# Altium schematic sheet Open Reactor Control System - Analogue & IO Interfaces.SchDoc: ORC - Analogue & IO Interfaces
size A3; Author: Peake J; CompanyName: Scion Research; DrawnBy: Peake J; Engineer: Peake J; Organization: Scion; Address1: 49 Sala St; Address2: Whakarewarewa; Address3: Rotorua; Address4: New Zealand 3010; DocumentNumber: 0-5; Revision: 2; SheetNumber: 4; SheetTotal: 5
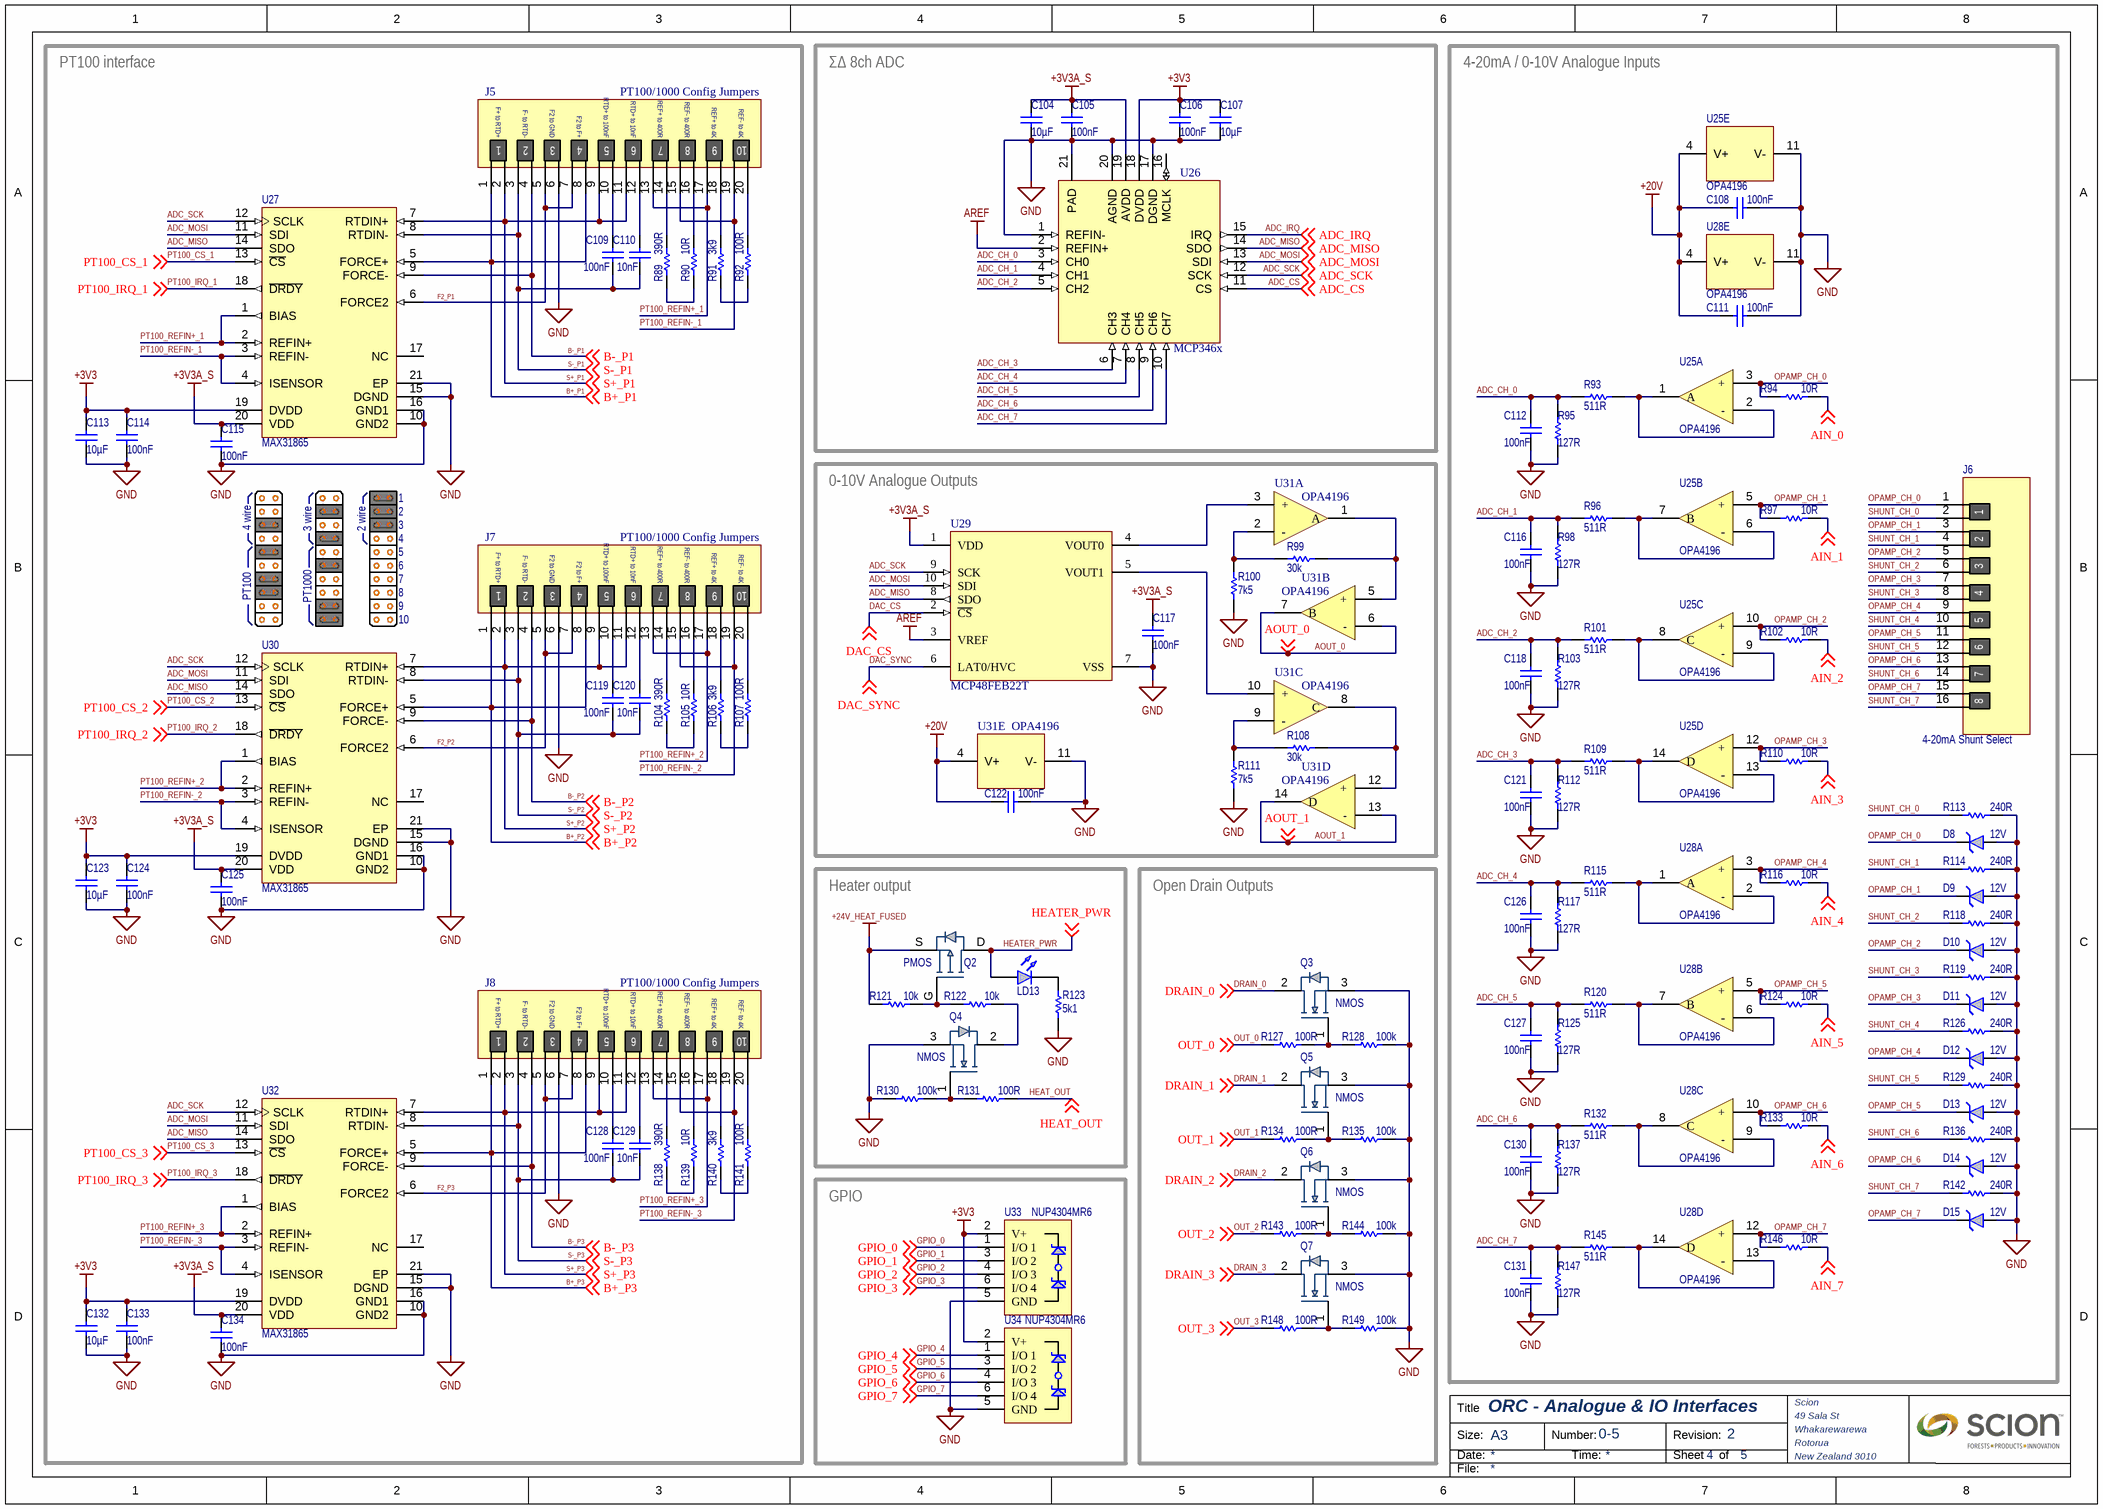
[diagram p0: Open Reactor Control System - Analogue & IO Interfaces.SchDoc]

## Parts
C104  value 10µF  [0603_CAP]  (hidden comment: Capacitor)
C105  value 100nF  [0603_CAP]  (hidden comment: Capacitor)
C106  value 100nF  [0603_CAP]  (hidden comment: Capacitor)
C107  value 10µF  [0603_CAP]  (hidden comment: Capacitor)
C108  value 100nF  [0603_CAP]  (hidden comment: Capacitor)
C109  value 100nF  [0603_CAP]  (hidden comment: Capacitor)
C110  value 10nF  [0603_CAP]  (hidden comment: Capacitor)
C111  value 100nF  [0603_CAP]  (hidden comment: Capacitor)
C112  value 100nF  [0603_CAP]  (hidden comment: Capacitor)
C113  value 10µF  [0603_CAP]  (hidden comment: Capacitor)
C114  value 100nF  [0603_CAP]  (hidden comment: Capacitor)
C115  value 100nF  [0603_CAP]  (hidden comment: Capacitor)
C116  value 100nF  [0603_CAP]  (hidden comment: Capacitor)
C117  value 100nF  [0603_CAP]  (hidden comment: Capacitor)
C118  value 100nF  [0603_CAP]  (hidden comment: Capacitor)
C119  value 100nF  [0603_CAP]  (hidden comment: Capacitor)
C120  value 10nF  [0603_CAP]  (hidden comment: Capacitor)
C121  value 100nF  [0603_CAP]  (hidden comment: Capacitor)
C122  value 100nF  [0603_CAP]  (hidden comment: Capacitor)
C123  value 10µF  [0603_CAP]  (hidden comment: Capacitor)
C124  value 100nF  [0603_CAP]  (hidden comment: Capacitor)
C125  value 100nF  [0603_CAP]  (hidden comment: Capacitor)
C126  value 100nF  [0603_CAP]  (hidden comment: Capacitor)
C127  value 100nF  [0603_CAP]  (hidden comment: Capacitor)
C128  value 100nF  [0603_CAP]  (hidden comment: Capacitor)
C129  value 10nF  [0603_CAP]  (hidden comment: Capacitor)
C130  value 100nF  [0603_CAP]  (hidden comment: Capacitor)
C131  value 100nF  [0603_CAP]  (hidden comment: Capacitor)
C132  value 10µF  [0603_CAP]  (hidden comment: Capacitor)
C133  value 100nF  [0603_CAP]  (hidden comment: Capacitor)
C134  value 100nF  [0603_CAP]  (hidden comment: Capacitor)
D8  Rated Voltage: 12V  [SMBJ]  (hidden comment: Transil)
D9  Rated Voltage: 12V  [SMBJ]  (hidden comment: Transil)
D10  Rated Voltage: 12V  [SMBJ]  (hidden comment: Transil)
D11  Rated Voltage: 12V  [SMBJ]  (hidden comment: Transil)
D12  Rated Voltage: 12V  [SMBJ]  (hidden comment: Transil)
D13  Rated Voltage: 12V  [SMBJ]  (hidden comment: Transil)
D14  Rated Voltage: 12V  [SMBJ]  (hidden comment: Transil)
D15  Rated Voltage: 12V  [SMBJ]  (hidden comment: Transil)
J5  PT100/1000 Config Jumpers  [20P 1.27mm SMD DIP male header]
J6  4-20mA Shunt Select  [16P 1.27mm SMD DIP male header]
J7  PT100/1000 Config Jumpers  [20P 1.27mm SMD DIP male header]
J8  PT100/1000 Config Jumpers  [20P 1.27mm SMD DIP male header]
LD13  LED  [0805]  (value not drawn)
Q2  PMOS  [PowerDI 5060-8]
Q3  NMOS  [SOT-23]
Q4  NMOS  [SOT-23]
Q5  NMOS  [SOT-23]
Q6  NMOS  [SOT-23]
Q7  NMOS  [SOT-23]
R89  value 390R  [0603_RES]  (hidden comment: Resistor)
R90  value 10R  [0603_RES]  (hidden comment: Resistor)
R91  value 3k9  [0603_RES]  (hidden comment: Resistor)
R92  value 100R  [0603_RES]  (hidden comment: Resistor)
R93  value 511R  [0603_RES]  (hidden comment: Resistor)
R94  value 10R  [0603_RES]  (hidden comment: Resistor)
R95  value 127R  [0603_RES]  (hidden comment: Resistor)
R96  value 511R  [0603_RES]  (hidden comment: Resistor)
R97  value 10R  [0603_RES]  (hidden comment: Resistor)
R98  value 127R  [0603_RES]  (hidden comment: Resistor)
R99  value 30k  [0603_RES]  (hidden comment: Resistor)
R100  value 7k5  [0603_RES]  (hidden comment: Resistor)
R101  value 511R  [0603_RES]  (hidden comment: Resistor)
R102  value 10R  [0603_RES]  (hidden comment: Resistor)
R103  value 127R  [0603_RES]  (hidden comment: Resistor)
R104  value 390R  [0603_RES]  (hidden comment: Resistor)
R105  value 10R  [0603_RES]  (hidden comment: Resistor)
R106  value 3k9  [0603_RES]  (hidden comment: Resistor)
R107  value 100R  [0603_RES]  (hidden comment: Resistor)
R108  value 30k  [0603_RES]  (hidden comment: Resistor)
R109  value 511R  [0603_RES]  (hidden comment: Resistor)
R110  value 10R  [0603_RES]  (hidden comment: Resistor)
R111  value 7k5  [0603_RES]  (hidden comment: Resistor)
R112  value 127R  [0603_RES]  (hidden comment: Resistor)
R113  value 240R  [1206_RES]  (hidden comment: Resistor)
R114  value 240R  [1206_RES]  (hidden comment: Resistor)
R115  value 511R  [0603_RES]  (hidden comment: Resistor)
R116  value 10R  [0603_RES]  (hidden comment: Resistor)
R117  value 127R  [0603_RES]  (hidden comment: Resistor)
R118  value 240R  [1206_RES]  (hidden comment: Resistor)
R119  value 240R  [1206_RES]  (hidden comment: Resistor)
R120  value 511R  [0603_RES]  (hidden comment: Resistor)
R121  value 10k  [0603_RES]  (hidden comment: Resistor)
R122  value 10k  [0603_RES]  (hidden comment: Resistor)
R123  value 5k1  [0603_RES]  (hidden comment: Resistor)
R124  value 10R  [0603_RES]  (hidden comment: Resistor)
R125  value 127R  [0603_RES]  (hidden comment: Resistor)
R126  value 240R  [1206_RES]  (hidden comment: Resistor)
R127  value 100R  [0603_RES]  (hidden comment: Resistor)
R128  value 100k  [0603_RES]  (hidden comment: Resistor)
R129  value 240R  [1206_RES]  (hidden comment: Resistor)
R130  value 100k  [0603_RES]  (hidden comment: Resistor)
R131  value 100R  [0603_RES]  (hidden comment: Resistor)
R132  value 511R  [0603_RES]  (hidden comment: Resistor)
R133  value 10R  [0603_RES]  (hidden comment: Resistor)
R134  value 100R  [0603_RES]  (hidden comment: Resistor)
R135  value 100k  [0603_RES]  (hidden comment: Resistor)
R136  value 240R  [1206_RES]  (hidden comment: Resistor)
R137  value 127R  [0603_RES]  (hidden comment: Resistor)
R138  value 390R  [0603_RES]  (hidden comment: Resistor)
R139  value 10R  [0603_RES]  (hidden comment: Resistor)
R140  value 3k9  [0603_RES]  (hidden comment: Resistor)
R141  value 100R  [0603_RES]  (hidden comment: Resistor)
R142  value 240R  [1206_RES]  (hidden comment: Resistor)
R143  value 100R  [0603_RES]  (hidden comment: Resistor)
R144  value 100k  [0603_RES]  (hidden comment: Resistor)
R145  value 511R  [0603_RES]  (hidden comment: Resistor)
R146  value 10R  [0603_RES]  (hidden comment: Resistor)
R147  value 127R  [0603_RES]  (hidden comment: Resistor)
R148  value 100R  [0603_RES]  (hidden comment: Resistor)
R149  value 100k  [0603_RES]  (hidden comment: Resistor)
U25  OPA4196  [SOIC_14]  (parts A,B,C,D,E of 5)
U26  MCP346x  [20P_TSSOP]
U27  MAX31865  [MAXM-T2055+5_L]
U28  OPA4196  [SOIC_14]  (parts A,B,C,D,E of 5)
U29  MCP48FEB22T  [FP-C04-021-UN-IPC_C]
U30  MAX31865  [MAXM-T2055+5_L]
U31  OPA4196  [SOIC_14]  (parts A,B,C,D,E of 5)
U32  MAX31865  [MAXM-T2055+5_L]
U33  NUP4304MR6  [TSOP-6]
U34  NUP4304MR6  [TSOP-6]

## Blocks framed on the sheet
PT100 interface: C109 C110 C113-C115 C119 C120 C123-C125 C128 C129 C132-C134 J5 J7 J8 R89-R92 R104-R107 R138-R141 U27 U30 U32
ΣΔ 8ch ADC: C104-C107 U26
4-20mA / 0-10V Analogue Inputs: C108 C111 C112 C116 C118 C121 C126 C127 C130 C131 D8-D15 J6 R93-R98 R101-R103 R109 R110 R112-R120 R124-R126 R129 R132 R133 R136 R137 R142 R145-R147 U25 U28
0-10V Analogue Outputs: C117 C122 R99 R100 R108 R111 U29 U31
Heater output: LD13 Q2 Q4 R121-R123 R130 R131
Open Drain Outputs: Q3 Q5-Q7 R127 R128 R134 R135 R143 R144 R148 R149
GPIO: U33 U34

## Nets
+3V3: C106.1 C107.1 C113.1 C114.1 C123.1 C124.1 C132.1 C133.1 U26.18(DVDD) U27.19(DVDD) U30.19(DVDD) U32.19(DVDD) U33.2(V+) U34.2(V+)
+3V3A_S: C104.1 C105.1 C115.1 C117.1 C125.1 C134.1 U26.19(AVDD) U27.20(VDD) U29.1(VDD) U30.20(VDD) U32.20(VDD)
+20V: C108.1 C111.1 C122.2 U25.4(V+) U28.4(V+) U31.4(V+)
+24V_HEAT_FUSED: Q2.S R121.2
AREF: U26.2(REFIN+) U29.3(VREF)
GND: C104.2 C105.2 C106.2 C107.2 C108.2 C111.2 C112.2 C113.2 C114.2 C115.2 C116.2 C117.2 C118.2 C121.2 C122.1 C123.2 C124.2 C125.2 C126.2 C127.2 C130.2 C131.2 C132.2 C133.2 C134.2 D8.1(A) D9.1(A) D10.1(A) D11.1(A) D12.1(A) D13.1(A) D14.1(A) D15.1(A) J5.6 J7.6 J8.6 Q3.3(S) Q4.3(S) Q5.3(S) Q6.3(S) Q7.3(S) R95.1 R98.1 R100.2 R103.1 R111.2 R112.1 R113.1 R114.1 R117.1 R118.1 R119.1 R123.1 R125.1 R126.1 R128.1 R129.1 R130.2 R135.1 R136.1 R137.1 R142.1 R144.1 R147.1 R149.1 U25.11(V-) U26.1(REFIN-) U26.17(DGND) U26.20(AGND) U26.21(PAD) U27.10(GND2) U27.15(DGND) U27.16(GND1) U27.21(EP) U28.11(V-) U29.7(VSS) U30.10(GND2) U30.15(DGND) U30.16(GND1) U30.21(EP) U31.11(V-) U32.10(GND2) U32.15(DGND) U32.16(GND1) U32.21(EP) U33.5(GND) U34.5(GND)
ADC_CH_0: C112.1 R93.2 R95.2 U26.3(CH0)
ADC_CH_1: C116.1 R96.2 R98.2 U26.4(CH1)
ADC_CH_2: C118.1 R101.2 R103.2 U26.5(CH2)
ADC_CH_3: C121.1 R109.2 R112.2 U26.6(CH3)
ADC_CH_4: C126.1 R115.2 R117.2 U26.7(CH4)
ADC_CH_5: C127.1 R120.2 R125.2 U26.8(CH5)
ADC_CH_6: C130.1 R132.2 R137.2 U26.9(CH6)
ADC_CH_7: C131.1 R145.2 R147.2 U26.10(CH7)
ADC_CS: U26.11(CS) ; off-sheet ADC_CS
ADC_IRQ: U26.15(IRQ) ; off-sheet ADC_IRQ
ADC_MISO: U26.14(SDO) U27.14(SDO) U29.8(SDO) U30.14(SDO) U32.14(SDO) ; off-sheet ADC_MISO
ADC_MOSI: U26.13(SDI) U27.11(SDI) U29.10(SDI) U30.11(SDI) U32.11(SDI) ; off-sheet ADC_MOSI
ADC_SCK: U26.12(SCK) U27.12(SCLK) U29.9(SCK) U30.12(SCLK) U32.12(SCLK) ; off-sheet ADC_SCK
AIN_0: R94.1 ; off-sheet AIN_0
AIN_1: R97.1 ; off-sheet AIN_1
AIN_2: R102.1 ; off-sheet AIN_2
AIN_3: R110.1 ; off-sheet AIN_3
AIN_4: R116.1 ; off-sheet AIN_4
AIN_5: R124.1 ; off-sheet AIN_5
AIN_6: R133.1 ; off-sheet AIN_6
AIN_7: R146.1 ; off-sheet AIN_7
AOUT_0: U31.6(-) U31.7(B) ; off-sheet AOUT_0
AOUT_1: U31.13(-) U31.14(D) ; off-sheet AOUT_1
B+_P1: J5.1 J5.8 U27.5(FORCE+) ; off-sheet B+_P1
B+_P2: J7.1 J7.8 U30.5(FORCE+) ; off-sheet B+_P2
B+_P3: J8.1 J8.8 U32.5(FORCE+) ; off-sheet B+_P3
B-_P1: J5.4 U27.9(FORCE-) ; off-sheet B-_P1
B-_P2: J7.4 U30.9(FORCE-) ; off-sheet B-_P2
B-_P3: J8.4 U32.9(FORCE-) ; off-sheet B-_P3
DAC_CS: U29.2(~{CS}) ; off-sheet DAC_CS
DAC_SYNC: U29.6(LAT0/HVC) ; off-sheet DAC_SYNC
DRAIN_0: Q3.2(D) ; off-sheet DRAIN_0
DRAIN_1: Q5.2(D) ; off-sheet DRAIN_1
DRAIN_2: Q6.2(D) ; off-sheet DRAIN_2
DRAIN_3: Q7.2(D) ; off-sheet DRAIN_3
F2_P1: J5.5 J5.7 U27.6(FORCE2)
F2_P2: J7.5 J7.7 U30.6(FORCE2)
F2_P3: J8.5 J8.7 U32.6(FORCE2)
GPIO_0: U33.1(I/O_1) ; off-sheet GPIO_0
GPIO_1: U33.3(I/O_2) ; off-sheet GPIO_1
GPIO_2: U33.4(I/O_3) ; off-sheet GPIO_2
GPIO_3: U33.6(I/O_4) ; off-sheet GPIO_3
GPIO_4: U34.1(I/O_1) ; off-sheet GPIO_4
GPIO_5: U34.3(I/O_2) ; off-sheet GPIO_5
GPIO_6: U34.4(I/O_3) ; off-sheet GPIO_6
GPIO_7: U34.6(I/O_4) ; off-sheet GPIO_7
HEAT_OUT: R131.1 ; off-sheet HEAT_OUT
HEATER_PWR: LD13.2(A) Q2.D ; off-sheet HEATER_PWR
OPAMP_CH_0: D8.2(K) J6.1 R94.2 U25.3(+)
OPAMP_CH_1: D9.2(K) J6.3 R97.2 U25.5(+)
OPAMP_CH_2: D10.2(K) J6.5 R102.2 U25.10(+)
OPAMP_CH_3: D11.2(K) J6.7 R110.2 U25.12(+)
OPAMP_CH_4: D12.2(K) J6.9 R116.2 U28.3(+)
OPAMP_CH_5: D13.2(K) J6.11 R124.2 U28.5(+)
OPAMP_CH_6: D14.2(K) J6.13 R133.2 U28.10(+)
OPAMP_CH_7: D15.2(K) J6.15 R146.2 U28.12(+)
OUT_0: R127.2 ; off-sheet OUT_0
OUT_1: R134.2 ; off-sheet OUT_1
OUT_2: R143.2 ; off-sheet OUT_2
OUT_3: R148.2 ; off-sheet OUT_3
PT100_CS_1: U27.13(~{CS}) ; off-sheet PT100_CS_1
PT100_CS_2: U30.13(~{CS}) ; off-sheet PT100_CS_2
PT100_CS_3: U32.13(~{CS}) ; off-sheet PT100_CS_3
PT100_IRQ_1: U27.18(~{DRDY}) ; off-sheet PT100_IRQ_1
PT100_IRQ_2: U30.18(~{DRDY}) ; off-sheet PT100_IRQ_2
PT100_IRQ_3: U32.18(~{DRDY}) ; off-sheet PT100_IRQ_3
PT100_REFIN+_1: J5.13 J5.17 U27.1(BIAS) U27.2(REFIN+)
PT100_REFIN+_2: J7.13 J7.17 U30.1(BIAS) U30.2(REFIN+)
PT100_REFIN+_3: J8.13 J8.17 U32.1(BIAS) U32.2(REFIN+)
PT100_REFIN-_1: J5.15 J5.19 U27.3(REFIN-) U27.4(ISENSOR)
PT100_REFIN-_2: J7.15 J7.19 U30.3(REFIN-) U30.4(ISENSOR)
PT100_REFIN-_3: J8.15 J8.19 U32.3(REFIN-) U32.4(ISENSOR)
S+_P1: J5.2 J5.9 J5.11 U27.7(RTDIN+) ; off-sheet S+_P1
S+_P2: J7.2 J7.9 J7.11 U30.7(RTDIN+) ; off-sheet S+_P2
S+_P3: J8.2 J8.9 J8.11 U32.7(RTDIN+) ; off-sheet S+_P3
S-_P1: C109.2 C110.2 J5.3 U27.8(RTDIN-) ; off-sheet S-_P1
S-_P2: C119.2 C120.2 J7.3 U30.8(RTDIN-) ; off-sheet S-_P2
S-_P3: C128.2 C129.2 J8.3 U32.8(RTDIN-) ; off-sheet S-_P3
SHUNT_CH_0: J6.2 R113.2
SHUNT_CH_1: J6.4 R114.2
SHUNT_CH_2: J6.6 R118.2
SHUNT_CH_3: J6.8 R119.2
SHUNT_CH_4: J6.10 R126.2
SHUNT_CH_5: J6.12 R129.2
SHUNT_CH_6: J6.14 R136.2
SHUNT_CH_7: J6.16 R142.2
NetC109_1: C109.1 J5.10
NetC110_1: C110.1 J5.12
NetC119_1: C119.1 J7.10
NetC120_1: C120.1 J7.12
NetC128_1: C128.1 J8.10
NetC129_1: C129.1 J8.12
NetJ5_14: J5.14 R89.2
NetJ5_16: J5.16 R90.2
NetJ5_18: J5.18 R91.2
NetJ5_20: J5.20 R92.2
NetJ7_14: J7.14 R104.2
NetJ7_16: J7.16 R105.2
NetJ7_18: J7.18 R106.2
NetJ7_20: J7.20 R107.2
NetJ8_14: J8.14 R138.2
NetJ8_16: J8.16 R139.2
NetJ8_18: J8.18 R140.2
NetJ8_20: J8.20 R141.2
NetLD13_1: LD13.1(K) R123.2
NetQ2_G: Q2.G R121.1 R122.2
NetQ3_1: Q3.1(G) R127.1 R128.2
NetQ4_1: Q4.1(G) R130.1 R131.2
NetQ4_2: Q4.2(D) R122.1
NetQ5_1: Q5.1(G) R134.1 R135.2
NetQ6_1: Q6.1(G) R143.1 R144.2
NetQ7_1: Q7.1(G) R148.1 R149.2
NetR89_1: R89.1 R90.1
NetR91_1: R91.1 R92.1
NetR93_1: R93.1 U25.1(A) U25.2(-)
NetR96_1: R96.1 U25.6(-) U25.7(B)
NetR99_1: R99.1 R100.1 U31.2(-)
NetR99_2: R99.2 U31.1(A) U31.5(+)
NetR101_1: R101.1 U25.8(C) U25.9(-)
NetR104_1: R104.1 R105.1
NetR106_1: R106.1 R107.1
NetR108_1: R108.1 R111.1 U31.9(-)
NetR108_2: R108.2 U31.8(C) U31.12(+)
NetR109_1: R109.1 U25.13(-) U25.14(D)
NetR115_1: R115.1 U28.1(A) U28.2(-)
NetR120_1: R120.1 U28.6(-) U28.7(B)
NetR132_1: R132.1 U28.8(C) U28.9(-)
NetR138_1: R138.1 R139.1
NetR140_1: R140.1 R141.1
NetR145_1: R145.1 U28.13(-) U28.14(D)
NetU29_4: U29.4(VOUT0) U31.3(+)
NetU29_5: U29.5(VOUT1) U31.10(+)

Not connected (* = marked no-connect by the designer): U26 16(MCLK); U27 17(NC); U30 17(NC); U32 17(NC)

## Notes on the sheet
- (near J5) 1
- (near J5) F+ to RTD+
- (near J5) 2
- (near J5) F- to RTD-
- (near J5) 3
- (near J5) F2 to GND
- (near J5) 4
- (near J5) F2 to F+
- (near J5) 5
- (near J5) RTD+ to 100nF
- (near J5) 6
- (near J5) RTD+ to 10nF
- (near J5) 7
- (near J5) REF+ to 400R
- (near J5) 8
- (near J5) REF- to 400R
- (near J5) 9
- (near J5) REF+ to 4K
- (near J5) 10
- (near J5) REF- to 4K
- 1
- 2
- (near J6) 1
- 4 wire
- 3 wire
- 2 wire
- 3
- 4
- 5
- 6
- 7
- 8
- (near J7) F+ to RTD+
- (near J7) F- to RTD-
- (near J7) F2 to GND
- (near J7) F2 to F+
- (near J7) RTD+ to 100nF
- (near J7) RTD+ to 10nF
- (near J7) REF+ to 400R
- (near J7) REF- to 400R
- (near J7) REF+ to 4K
- (near J7) REF- to 4K
- (near J6) 2
- (near J6) 3
- (near J6) 4
- PT100
- PT1000
- 9
- (near U30) 10
- (near J7) 1
- (near J7) 2
- (near J7) 3
- (near J7) 4
- (near J7) 5
- (near J7) 6
- (near J7) 7
- (near J7) 8
- (near J7) 9
- (near J7) 10
- (near J6) 5
- (near J6) 6
- (near J6) 7
- (near J6) 8
- (near J8) 1
- (near J8) F+ to RTD+
- (near J8) 2
- (near J8) F- to RTD-
- (near J8) 3
- (near J8) F2 to GND
- (near J8) 4
- (near J8) F2 to F+
- (near J8) 5
- (near J8) RTD+ to 100nF
- (near J8) 6
- (near J8) RTD+ to 10nF
- (near J8) 7
- (near J8) REF+ to 400R
- (near J8) 8
- (near J8) REF- to 400R
- (near J8) 9
- (near J8) REF+ to 4K
- (near J8) 10
- (near J8) REF- to 4K
- Title
- Size:
- Date:
- A3
- Number:
- Time:
- Revision:
- Sheet
- of
- File:

## Library data of the parts
C104-C134 = CMP-001-00172-2: SMD Capacitor; Pins: 2; Source: Discrete.SchLib; Component Type: Standard; Design Item ID: Capacitor
D8-D15 = CMP-079-000108-2: Transient Voltage Suppressor; MFN: SMBJ33A; Component Type: Standard; Pin Count: 2; Source: Discrete.SchLib; Breakdown Voltage: *; Design Item ID: Transil; Clamping Voltage: *
J5 J7 J8 = CMP-002-00001-4: 20 pin connector
J6 = CMP-002-00172-3: 16 Pin Connector; Component Type: Standard; Pin Count: 16; Pins: 16; Design Item ID: 16_Pin; Source: Connectors.SchLib
LD13 = CMP-004-00084-3: SMD LED; Colour: RED; Pins: 2; Source: Discrete.SchLib; Design Item ID: LED; Component Type: Standard; Pin Count: 2
Q2 = CMP-079-000102-2: P Channel MOSFET; MFN: *; Design Item ID: PMOS GDS; VGS Max: *; Continuous Current: *; VDS Breakdown: *; Source: P-MOS.SchLib; Component Type: Standard; Pin Count: 3
Q3-Q7 = CMP-079-000093-2: N Channel MOSFET; Design Item ID: NMOS; Source: N-MOS.SchLib; MFN: *; Pin Count: 3; Component Type: Standard
R89-R112 R115-R117 R120-R122 R124 R125 R127 R128 R130-R135 R137-R141 R143-R149 = CMP-009-00356-3: SMD Resistor; Component Type: Standard; Source: Discrete.SchLib; Design Item ID: Resistor; Pins: 2
R113 R114 R118 R119 R126 R129 R136 R142 = CMP-009-00356-1: SMD Resistor; Value: 240R; Pins: 2; Source: Discrete.SchLib; Component Type: Standard; Design Item ID: Resistor
R123 = CMP-009-00356-1: SMD Resistor; Pins: 2; Source: Discrete.SchLib; Component Type: Standard; Design Item ID: Resistor
U25 U28 U31 = CMP-014-00038-1: Quad 36V OpAmp; Source: Texas Instruments.SchLib; Pin Count: 14; Design Item ID: OPA4196; Component Type: Standard
U26 = CMP-008-000006-5: MCP3461/2/4 S? ADC; MFN: MCP3461; Component Type: Standard; Design Item ID: MCP346x; Source: Microchip.SchLib; Pin Count: 21
U27 U30 U32 = CMP-031-00050-2: IC RTD TO DIGITAL CONVERT 20TQFN; Interface: SPI; Series: -; Package Quantity: 2500; Max Operating Temperature: 125°C; Case/Package: QFN; Output Type: SPI; Radiation Hardening: No; Packaging: Tape and Reel; RoHS Compliant: Yes; Min Operating Temperature: -40°C; Pin Count: 21; Pins: 20; Source: All Components - 30.06.23 - 18.27.SchLib; Component Type: Standard; Design Item ID: CMP-00054-1
U29 = CMP-00024-00002-1: D/A Converter, 1 Func, Serial Input Loading, 7.8us Settling Time, PDSO10; Nominal Supply Voltage: 5.5V; Case/Package: TSSOP; Pins: 10; Min Operating Temperature: -40°C; RoHS Compliant: Yes; Max Operating Temperature: 125°C
U33 U34 = CMP-079-000096-2: ESD Protection Doide Array; Design Item ID: NUP4304MR6; Pin Count: 6; Component Type: Standard; Source: ON Semi.SchLib